# EAGLE schematic MJ808 clone - rev.5 - poc (EAGLE 9.6.2)
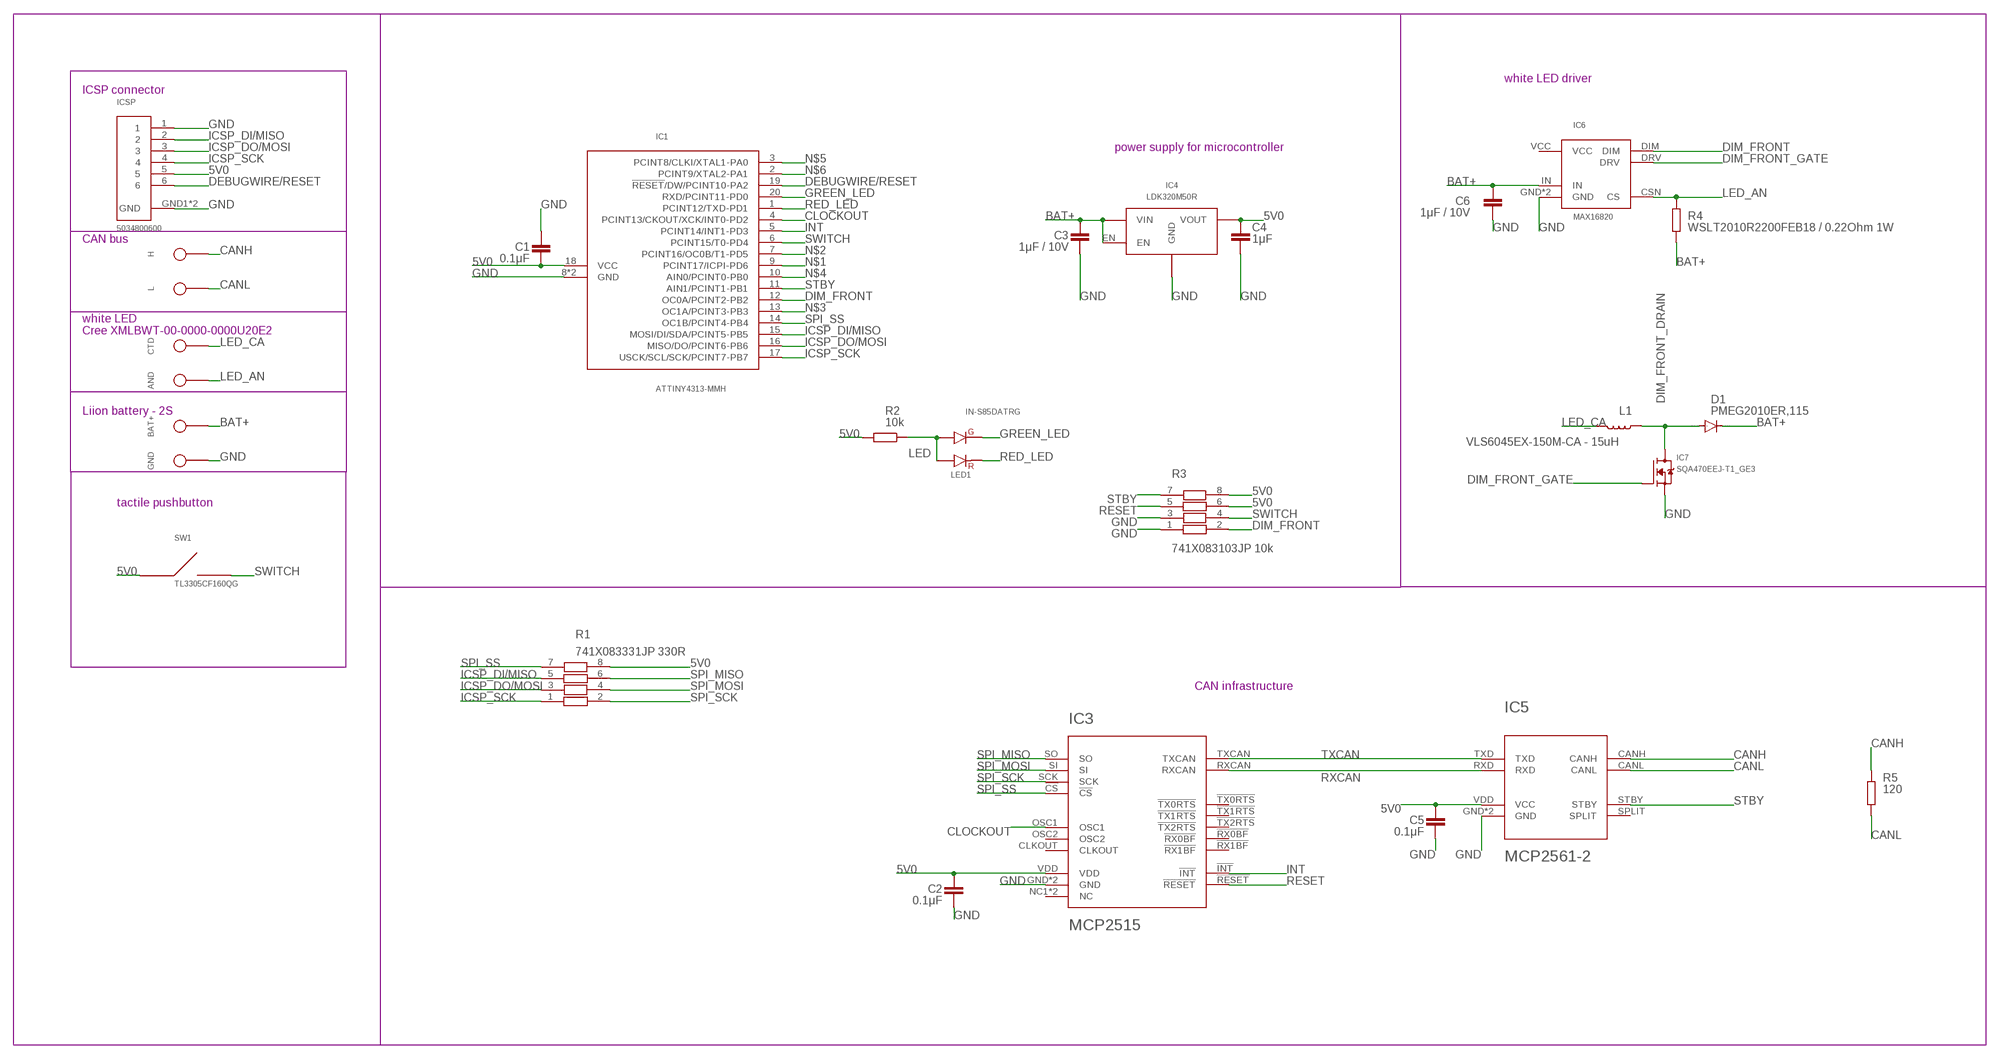
[diagram p0: schematic, sheet 1]

## Parts
AND  LED anode  TPTH-1.2MM  [TH-1.2MM]
BAT+  LiIon + Terminal  TPTH-1.2MM  [TH-1.2MM]
C1  0.1μF  C-EUC0402  [C0402]
C2  0.1μF  C-EUC0402  [C0402]
C3  1μF / 10V  C-EUC0402  [C0402]
C4  1μF  C-EUC0402  [C0402]
C5  0.1μF  C-EUC0402  [C0402]
C6  1μF / 10V  C-EUC0402  [C0402]
CTD  LED cathode  TPTH-1.2MM  [TH-1.2MM]
D1  PMEG2010ER,115  DIODE-SOD123  [SOD123]
GND  LiIon - Terminal  TPTH-1.2MM  [TH-1.2MM]
H  CAN high  TPTH-1.2MM  [TH-1.2MM]
IC1  ATTINY4313-MMH  ATTINY4313VQFN-20  [VQFN-20]
IC3  MCP2515  MCP2515-I-ML  [QFN20]
IC4  LDK320M50R  LDK320SOT-23-5L  [SOT-23-5L]
IC5  MCP2561-2  [DFN10]
IC6  MAX16820  [TDFN-6-EP]
IC7  SQA470EEJ-T1_GE3  SIA456DJ  [SC-70-6]
ICSP  5034800600  5034800600  [SMT]
L  CAN low  TPTH-1.2MM  [TH-1.2MM]
L1  VLS6045EX-150M-CA - 15uH  INDUCTOR-SRN6045-33UH  [SRN6045]
LED1  IN-S85DATRG  APHBM2012LSURKZGKC  [SMD]
R1  741X083331JP 330R  741X083331JP  [0402-4R]
R2  10k  R-EU_R0402  [R0402]
R3  741X083103JP 10k  741X083331JP  [0402-4R]
R4  WSLT2010R2200FEB18 / 0.22Ohm 1W  R-EU_R2010  [R2010]
R5  120  R-EU_R0805  [R0805]
SW1  TL3305CF160QG  TL3305-844809  [SMD]

## Nets
5V0 [5v0]: C1.1 C2.1 C4.2 C5.1 IC1.18(VCC) IC3.VDD IC4.OUT(VOUT) IC5.VDD(VCC) ICSP.5 R1.8 R2.2 R3.6 R3.8 SW1.1 SW1.2
BAT+ [BAT+]: BAT+.TP$1 C3.1 C6.1 D1.C IC4.EN IC4.IN(VIN) IC6.IN R4.2
CANH [signal]: H.TP$1 IC5.CANH R5.2
CANL [signal]: IC5.CANL L.TP$1 R5.1
CLOCKOUT [signal]: IC1.4(PCINT13/CKOUT/XCK/INT0-PD2) IC3.OSC1
DEBUGWIRE/RESET [signal]: IC1.19(!RESET!/DW/PCINT10-PA2) ICSP.6
DIM_FRONT [signal]: IC1.12(OC0A/PCINT2-PB2) IC6.DIM R3.2
DIM_FRONT_DRAIN: D1.A IC7.1D(D) IC7.2D(D) IC7.5D(D) IC7.6D(D) IC7.D L1.1
DIM_FRONT_GATE [signal]: IC6.DRV IC7.3G(G)
GND: C1.2 C2.2 C3.2 C4.1 C5.2 C6.2 GND.TP$1 IC1.8(GND) IC1.GND IC3.GND IC3.GND6(GND) IC4.GND IC5.GND IC5.VSS(GND) IC6.GND IC6.GND1(GND) IC7.4S(S) IC7.S ICSP.1 ICSP.GND1(GND) ICSP.GND2(GND) R3.1 R3.3
GREEN_LED [signal]: IC1.20(RXD/PCINT11-PD0) LED1.3
ICSP_DI/MISO [signal]: IC1.15(MOSI/DI/SDA/PCINT5-PB5) ICSP.2 R1.5
ICSP_DO/MOSI [signal]: IC1.16(MISO/DO/PCINT6-PB6) ICSP.3 R1.3
ICSP_SCK [signal]: IC1.17(USCK/SCL/SCK/PCINT7-PB7) ICSP.4 R1.1
INT [signal]: IC1.5(PCINT14/INT1-PD3) IC3.!INT!
LED [signal]: LED1.1 LED1.4 R2.1
LED_AN: AND.TP$1 IC6.CSN(CS) R4.1
LED_CA: CTD.TP$1 L1.2
N$1: IC1.9(PCINT17/ICPI-PD6)
N$2: IC1.7(PCINT16/OC0B/T1-PD5)
N$3: IC1.13(OC1A/PCINT3-PB3)
N$4: IC1.10(AIN0/PCINT0-PB0)
N$5: IC1.3(PCINT8/CLKI/XTAL1-PA0)
N$6: IC1.2(PCINT9/XTAL2-PA1)
RED_LED [signal]: IC1.1(PCINT12/TXD-PD1) LED1.2
RESET [signal]: IC3.!RESET! R3.5
RXCAN [signal]: IC3.RXCAN IC5.RXD
SPI_MISO [signal]: IC3.SO R1.6
SPI_MOSI: IC3.SI R1.4
SPI_SCK: IC3.SCK R1.2
SPI_SS [signal]: IC1.14(OC1B/PCINT4-PB4) IC3.!CS! R1.7
STBY [signal]: IC1.11(AIN1/PCINT1-PB1) IC5.STBY R3.7
SWITCH [signal]: IC1.6(PCINT15/T0-PD4) R3.4 SW1.3 SW1.4
TXCAN [signal]: IC3.TXCAN IC5.TXD
Unconnected: IC3.!RX0BF! IC3.!RX1BF! IC3.!TX0RTS! IC3.!TX1RTS! IC3.!TX2RTS! IC3.CLKOUT IC3.NC1(NC) IC3.NC2(NC) IC3.OSC2 IC5.SPLIT

## Notes on the sheet
- white LED driver
- ICSP connector
- power supply for microcontroller
- CAN bus
- white LED
  Cree XMLBWT-00-0000-0000U20E2
- Liion battery - 2S
- tactile pushbutton
- CAN infrastructure

## Power pins joined to a net without a drawn wire
VCC: IC6.VCC

## Library data of the parts
AND BAT+ CTD GND H L = signal testpoint:TP
C1-C6 = rcl:C-EU: CAPACITOR, European symbol; SPICEPREFIX: C
D1 = diode:DIODE-: DIODE
IC1 = ATtiny4313 microcontroller:ATTINY4313; SPICEPREFIX: X
IC3 = MCP2515-I-ML - Standalonce CAN Controller with SPI Interface:MCP2515-I-ML
IC4 = LDK320 5V LDO:LDK320
IC5 = MCP2561-2 - High-Speed CAN Transceiver:MCP2561-2
IC6 = MAX16820 LED Driver, constant current:MAX16820
IC7 = SIA456DJ-T1-GE3  N-Fet:SIA456DJ
ICSP = 5034800600 FPC Connector:5034800600
L1 = SparkFun-Coils:INDUCTOR: Inductors Resist changes in electrical current. Basically a coil of wire. SparkFun Products: SparkFun Load Cell Amplifier - HX711 <https://www.sparkfun.com/products/13879> IOIO-OTG - V2.2 <https://www.sparkfun.com/products/13613>; PROD_ID: NDUC-11627; VALUE: 33µH/±20%/1.4A
LED1 = APHBM2012LSURKZGKC:APHBM2012LSURKZGKC
R1 R3 = 74x-1133528 Resistor Array:741X083331JP
R2 R4 R5 = rcl:R-EU_: RESISTOR, European symbol; SPICEPREFIX: R
SW1 = TL3305-844809 SPST-NO Tact Switch:TL3305-844809

## Net classes
0 GND: width 0.25 mm, drill 0.35 mm, clearance 0.19 mm
1 BAT+: width 0.5 mm, drill 0.35 mm, clearance 0.19 mm
2 5v0: width 0.3 mm, drill 0.35 mm, clearance 0.19 mm
3 signal: width 0.25 mm, drill 0.35 mm, clearance 0.19 mm